# Altium schematic sheet PAGE02 POWER DISTRIBUTI.SchDoc
size 420 x 297 mm; SheetNumber: 2; SheetTotal: 9
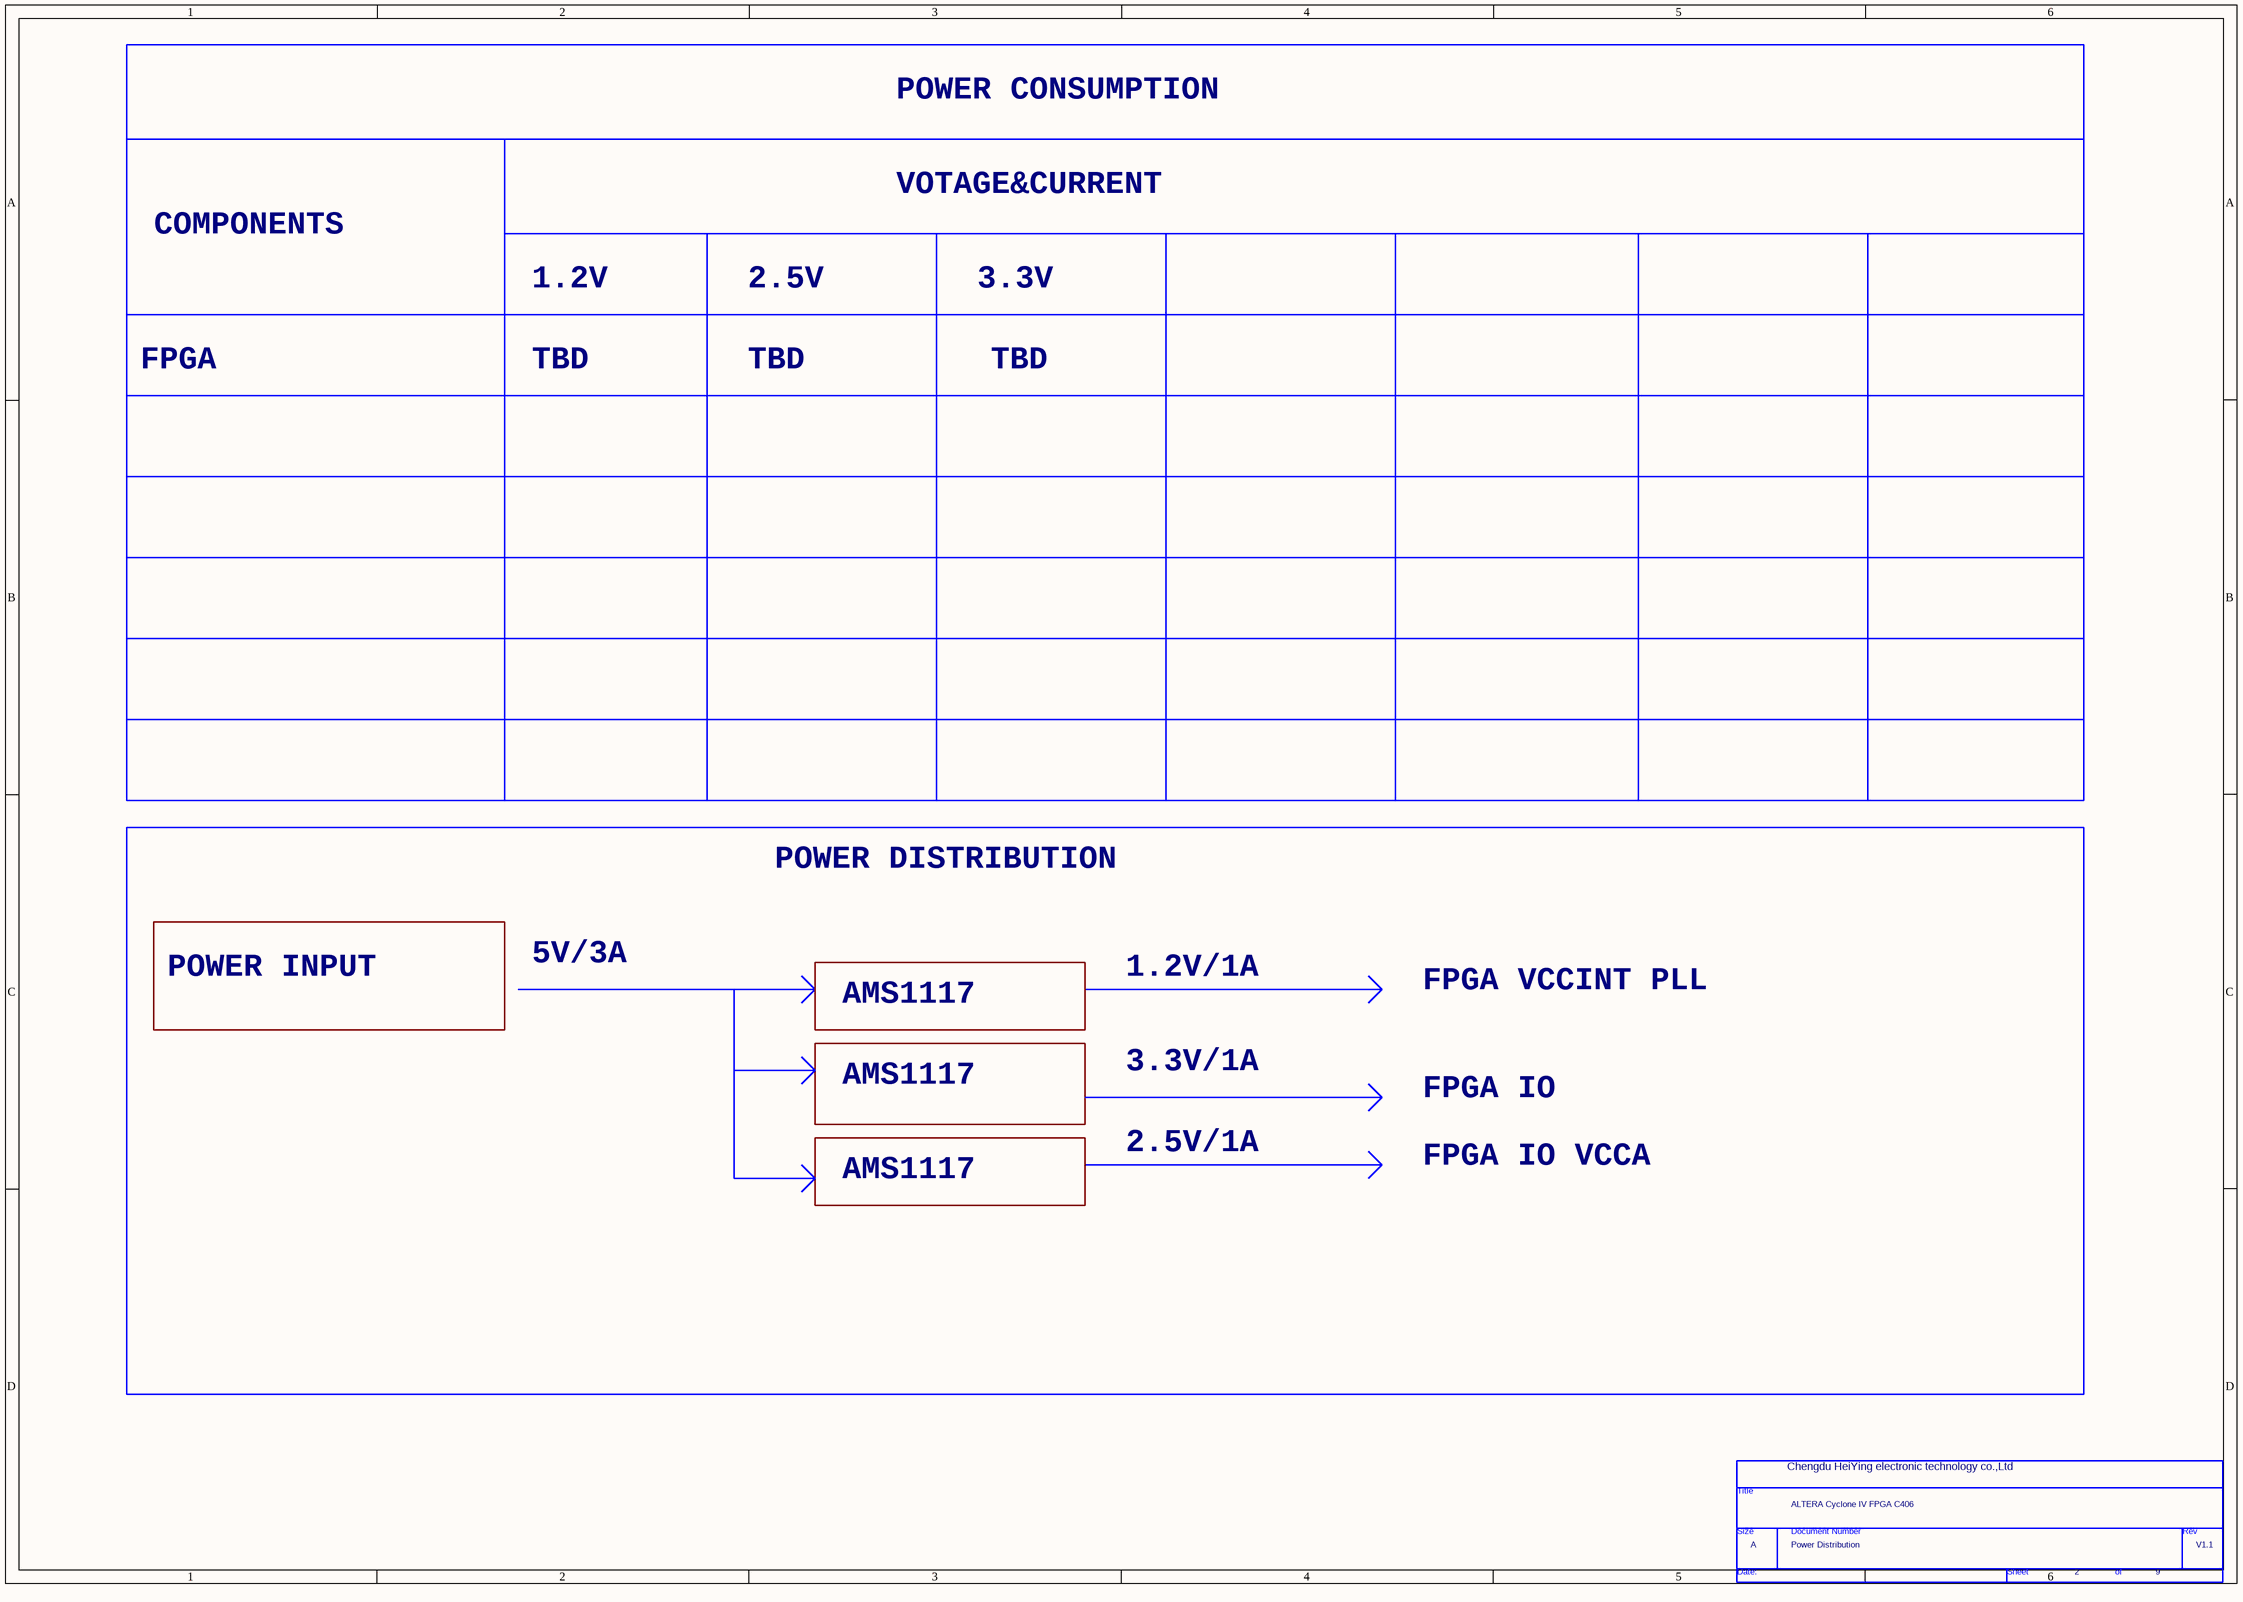
[diagram p0: PAGE02 POWER DISTRIBUTI.SchDoc]

## Parts
*  Page Count: 9  Page Number: 2  Page Size: A  Title: ALTERA Cyclone IV FPGA C406  RevCode: V1.1  Doc: Power Distribution  (hidden comment: TitleBlock0)  (graphical)

## Notes on the sheet
- POWER CONSUMPTION
- COMPONENTS
- VOTAGE&CURRENT
- 1.2V
- 2.5V
- 3.3V
- FPGA
- TBD
- POWER DISTRIBUTION
- POWER INPUT
- 5V/3A
- 1.2V/1A
- FPGA VCCINT PLL
- AMS1117
- 3.3V/1A
- FPGA IO
- 2.5V/1A
- FPGA IO VCCA
- (near *) Chengdu HeiYing electronic technology co.,Ltd
- (in symbol TitleBlock0) Title; Size; Document Number; Rev; Date:; Sheet; of

## Library data of the parts
* = TitleBlock0: Page Create Date: March  8, 1995